# Altium schematic sheet parent_schematic.SchDoc
size Letter; SheetNumber: 1; SheetTotal: 4
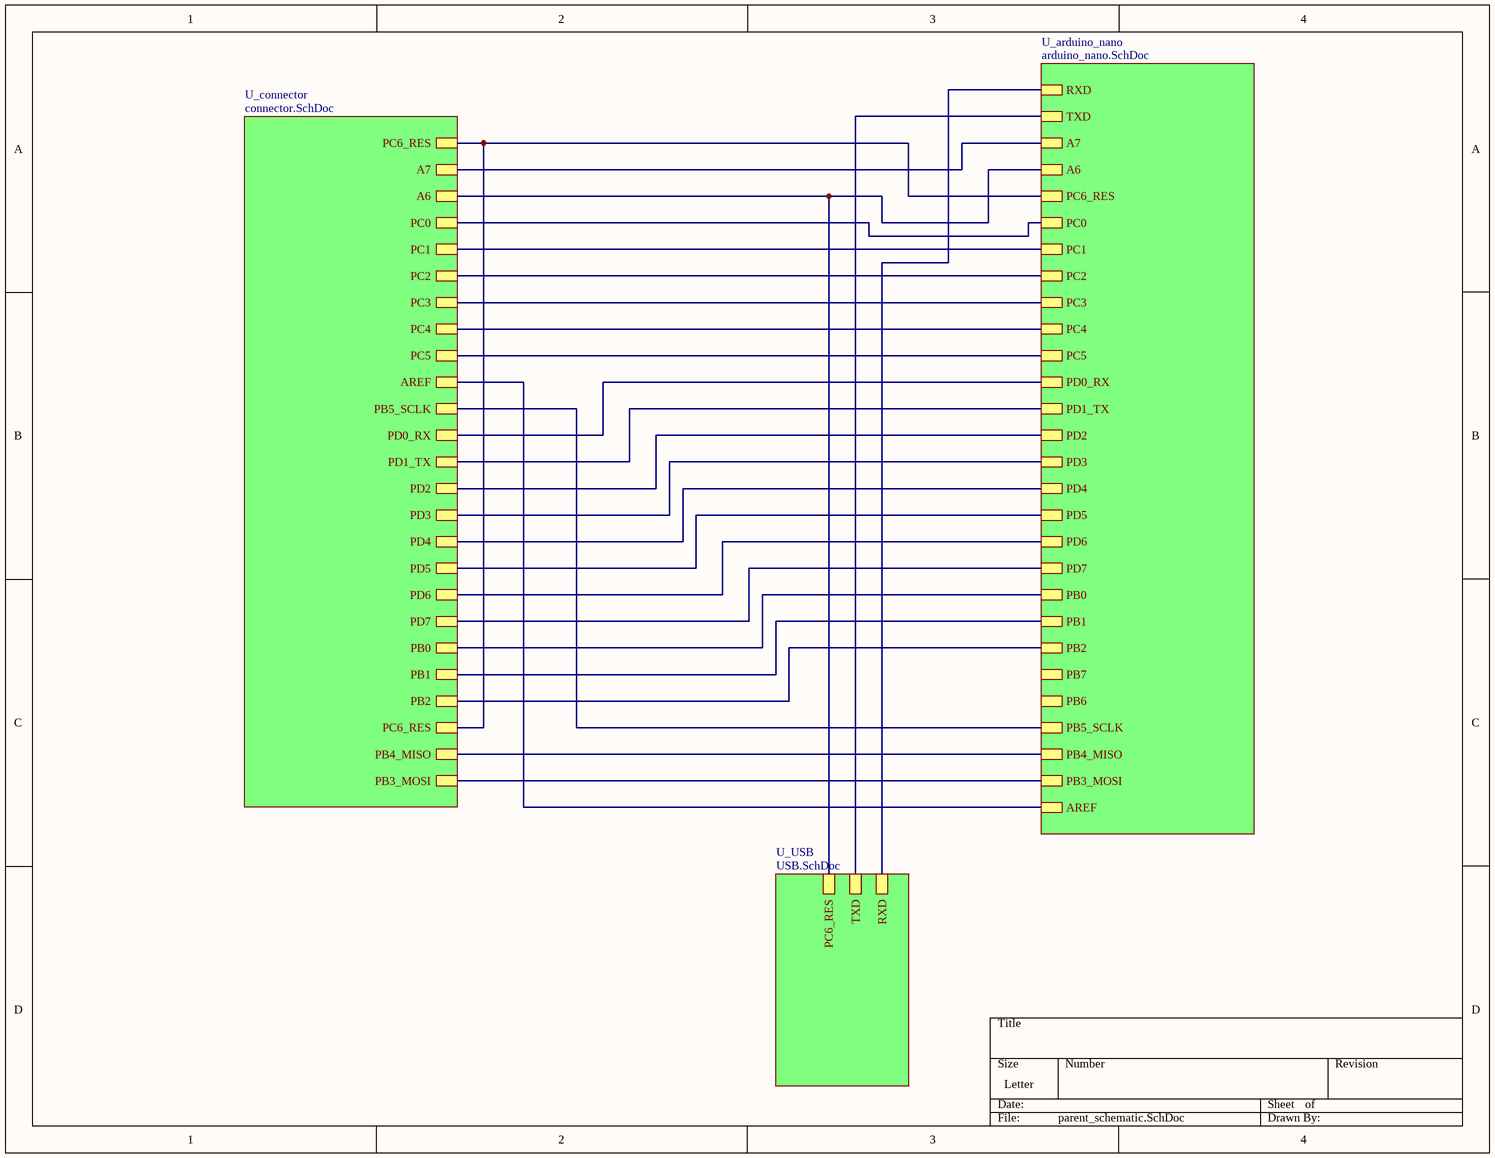
[diagram p0: parent_schematic.SchDoc]

## Sub-sheets
U_arduino_nano = arduino_nano.SchDoc: RXD, TXD, A7, A6, PC6_RES, PC0, PC1, PC2, PC3, PC4, PC5, PD0_RX, PD1_TX, PD2, PD3, PD4, PD5, PD6, PD7, PB0, PB1, PB2, PB7, PB6, PB5_SCLK, PB4_MISO, PB3_MOSI, AREF
U_connector = connector.SchDoc: PC6_RES, A7, A6, PC0, PC1, PC2, PC3, PC4, PC5, AREF, PB5_SCLK, PD0_RX, PD1_TX, PD2, PD3, PD4, PD5, PD6, PD7, PB0, PB1, PB2, PC6_RES, PB4_MISO, PB3_MOSI
U_USB = USB.SchDoc: RXD, TXD, PC6_RES

## Nets
(unnamed): sheet U_arduino_nano/RXD, sheet U_USB/RXD
(unnamed): sheet U_arduino_nano/TXD, sheet U_USB/TXD
(unnamed): sheet U_arduino_nano/A7, sheet U_connector/A7
(unnamed): sheet U_arduino_nano/A6, sheet U_connector/A6, sheet U_USB/PC6_RES
(unnamed): sheet U_arduino_nano/PC6_RES, sheet U_connector/PC6_RES, sheet U_connector/PC6_RES
(unnamed): sheet U_arduino_nano/PC0, sheet U_connector/PC0
(unnamed): sheet U_arduino_nano/PC1, sheet U_connector/PC1
(unnamed): sheet U_arduino_nano/PC2, sheet U_connector/PC2
(unnamed): sheet U_arduino_nano/PC3, sheet U_connector/PC3
(unnamed): sheet U_arduino_nano/PC4, sheet U_connector/PC4
(unnamed): sheet U_arduino_nano/PC5, sheet U_connector/PC5
(unnamed): sheet U_arduino_nano/PD0_RX, sheet U_connector/PD0_RX
(unnamed): sheet U_arduino_nano/PD1_TX, sheet U_connector/PD1_TX
(unnamed): sheet U_arduino_nano/PD2, sheet U_connector/PD2
(unnamed): sheet U_arduino_nano/PD3, sheet U_connector/PD3
(unnamed): sheet U_arduino_nano/PD4, sheet U_connector/PD4
(unnamed): sheet U_arduino_nano/PD5, sheet U_connector/PD5
(unnamed): sheet U_arduino_nano/PD6, sheet U_connector/PD6
(unnamed): sheet U_arduino_nano/PD7, sheet U_connector/PD7
(unnamed): sheet U_arduino_nano/PB0, sheet U_connector/PB0
(unnamed): sheet U_arduino_nano/PB1, sheet U_connector/PB1
(unnamed): sheet U_arduino_nano/PB2, sheet U_connector/PB2
(unnamed): sheet U_arduino_nano/PB5_SCLK, sheet U_connector/PB5_SCLK
(unnamed): sheet U_arduino_nano/PB4_MISO, sheet U_connector/PB4_MISO
(unnamed): sheet U_arduino_nano/PB3_MOSI, sheet U_connector/PB3_MOSI
(unnamed): sheet U_arduino_nano/AREF, sheet U_connector/AREF